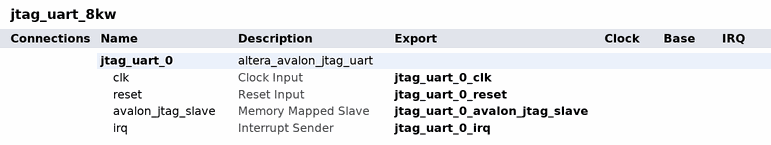
[diagram p0: system contents]
# Platform Designer (Qsys) system jtag_uart_8kw, MAX 10 10M50DAF484C6GES
# Parameters at their usual value, and those the tool derives, are not listed.
package require -exact qsys 17.0
create_system jtag_uart_8kw
set_project_property DEVICE_FAMILY {MAX 10}
set_project_property DEVICE 10M50DAF484C6GES

add_instance jtag_uart_0 altera_avalon_jtag_uart 17.0
set_instance_parameter_value jtag_uart_0 simInteractiveOptions NO_INTERACTIVE_WINDOWS
set_instance_parameter_value jtag_uart_0 writeBufferDepth 8192

# exported interfaces
add_interface jtag_uart_0_avalon_jtag_slave avalon slave
set_interface_property jtag_uart_0_avalon_jtag_slave EXPORT_OF jtag_uart_0.avalon_jtag_slave
add_interface jtag_uart_0_clk clock sink
set_interface_property jtag_uart_0_clk EXPORT_OF jtag_uart_0.clk
add_interface jtag_uart_0_irq interrupt sender
set_interface_property jtag_uart_0_irq EXPORT_OF jtag_uart_0.irq
add_interface jtag_uart_0_reset reset sink
set_interface_property jtag_uart_0_reset EXPORT_OF jtag_uart_0.reset

set_interconnect_requirement {$system} qsys_mm.clockCrossingAdapter HANDSHAKE
set_interconnect_requirement {$system} qsys_mm.enableEccProtection FALSE
set_interconnect_requirement {$system} qsys_mm.insertDefaultSlave FALSE
set_interconnect_requirement {$system} qsys_mm.maxAdditionalLatency 1

save_system jtag_uart_8kw.qsys
